# EAGLE schematic SoftPoweroff (EAGLE 7.6.0)
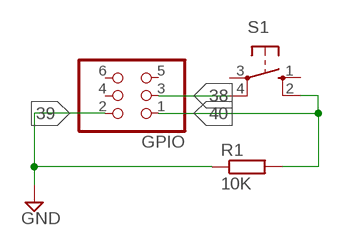
[diagram p0: schematic, sheet 1]

## Parts
GPIO  PINHD-2X3  [2X03]
R1  10K  R-EU_0207/10  [0207/10]
S1  10-XX  [B3F-10XX]

## Nets
38: GPIO.3 S1.4(P1)
39: GPIO.2 R1.1 ; supply symbol labelled GND
40: GPIO.1 R1.2 S1.2(S1)
Unconnected: GPIO.4 GPIO.5 GPIO.6 S1.1(S) S1.3(P)

## Library data of the parts
GPIO = pinhead:PINHD-2X3: PIN HEADER
R1 = rcl:R-EU_: RESISTOR, European symbol
S1 = switch-omron:10-XX: OMRON SWITCH; MPN: B3F-1000; OC_FARNELL: 176432; OC_NEWARK: 36M3542